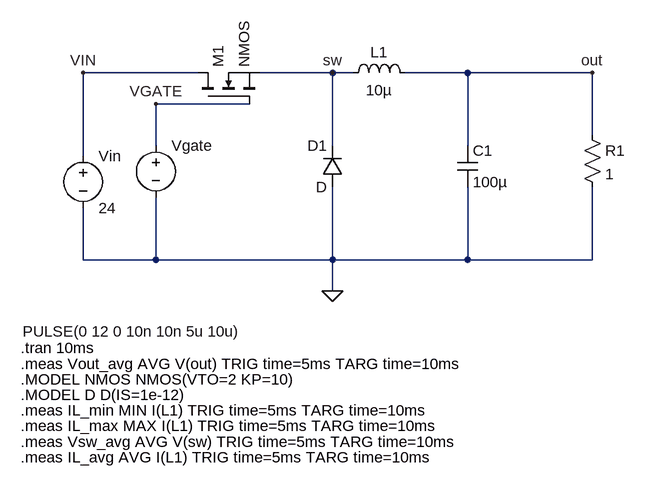
[diagram p0: schematic buck.asc]
buck.asc, the LTspice schematic file:
Version 4
SHEET 1 880 704
WIRE -80 96 -256 96
WIRE 128 96 16 96
WIRE 160 96 128 96
WIRE 336 96 240 96
WIRE 528 96 336 96
WIRE 0 144 -144 144
WIRE 528 192 528 96
WIRE -144 208 -144 144
WIRE 128 208 128 96
WIRE 336 208 336 96
WIRE -256 224 -256 96
WIRE -256 384 -256 304
WIRE -144 384 -144 288
WIRE -144 384 -256 384
WIRE 128 384 128 272
WIRE 128 384 -144 384
WIRE 336 384 336 272
WIRE 336 384 128 384
WIRE 528 384 528 272
WIRE 528 384 336 384
WIRE 128 432 128 384
FLAG 128 432 0
FLAG -256 96 VIN
FLAG 528 96 out
FLAG -144 144 VGATE
FLAG 128 96 sw
SYMBOL voltage -256 208 R0
WINDOW 123 0 0 Left 0
WINDOW 39 0 0 Left 0
SYMATTR InstName Vin
SYMATTR Value 24
SYMBOL voltage -144 192 R0
WINDOW 123 0 0 Left 0
WINDOW 39 0 0 Left 0
WINDOW 3 -205 302 Left 2
SYMATTR Value PULSE(0 12 0 10n 10n 5u 10u)
SYMATTR InstName Vgate
SYMBOL nmos -80 144 R270
SYMATTR InstName M1
SYMBOL diode 144 272 R180
WINDOW 0 24 64 Left 2
WINDOW 3 24 0 Left 2
SYMATTR InstName D1
SYMBOL ind 144 112 R270
WINDOW 0 32 56 VTop 2
WINDOW 3 5 56 VBottom 2
SYMATTR InstName L1
SYMATTR Value 10µ
SYMBOL cap 320 208 R0
SYMATTR InstName C1
SYMATTR Value 100µ
SYMBOL res 512 176 R0
SYMATTR InstName R1
SYMATTR Value 1
TEXT -352 520 Left 2 !.tran 10ms
TEXT -352 544 Left 2 !.meas Vout_avg AVG V(out) TRIG time=5ms TARG time=10ms
TEXT -352 664 Left 2 !.meas Vsw_avg AVG V(sw) TRIG time=5ms TARG time=10ms
TEXT -352 688 Left 2 !.meas IL_avg AVG I(L1) TRIG time=5ms TARG time=10ms
TEXT -352 616 Left 2 !.meas IL_min MIN I(L1) TRIG time=5ms TARG time=10ms
TEXT -352 640 Left 2 !.meas IL_max MAX I(L1) TRIG time=5ms TARG time=10ms
TEXT -352 568 Left 2 !.MODEL NMOS NMOS(VTO=2 KP=10)
TEXT -352 592 Left 2 !.MODEL D D(IS=1e-12)

The netlist it stands for:
* buck.asc
Vin VIN 0 24
Vgate VGATE 0 PULSE(0 12 0 10n 10n 5u 10u)
M1 VIN VGATE sw sw NMOS
D1 0 sw D
L1 sw out 10µ
C1 out 0 100µ
R1 out 0 1
.model D D
.lib standard.dio
.model NMOS NMOS
.model PMOS PMOS
.lib standard.mos
.tran 10ms
.meas Vout_avg AVG V(out) TRIG time=5ms TARG time=10ms
.meas Vsw_avg AVG V(sw) TRIG time=5ms TARG time=10ms
.meas IL_avg AVG I(L1) TRIG time=5ms TARG time=10ms
.meas IL_min MIN I(L1) TRIG time=5ms TARG time=10ms
.meas IL_max MAX I(L1) TRIG time=5ms TARG time=10ms
.MODEL NMOS NMOS(VTO=2 KP=10)
.MODEL D D(IS=1e-12)
.backanno
.end